# Altium project Shutdown_2019_v1.1.PrjPcb
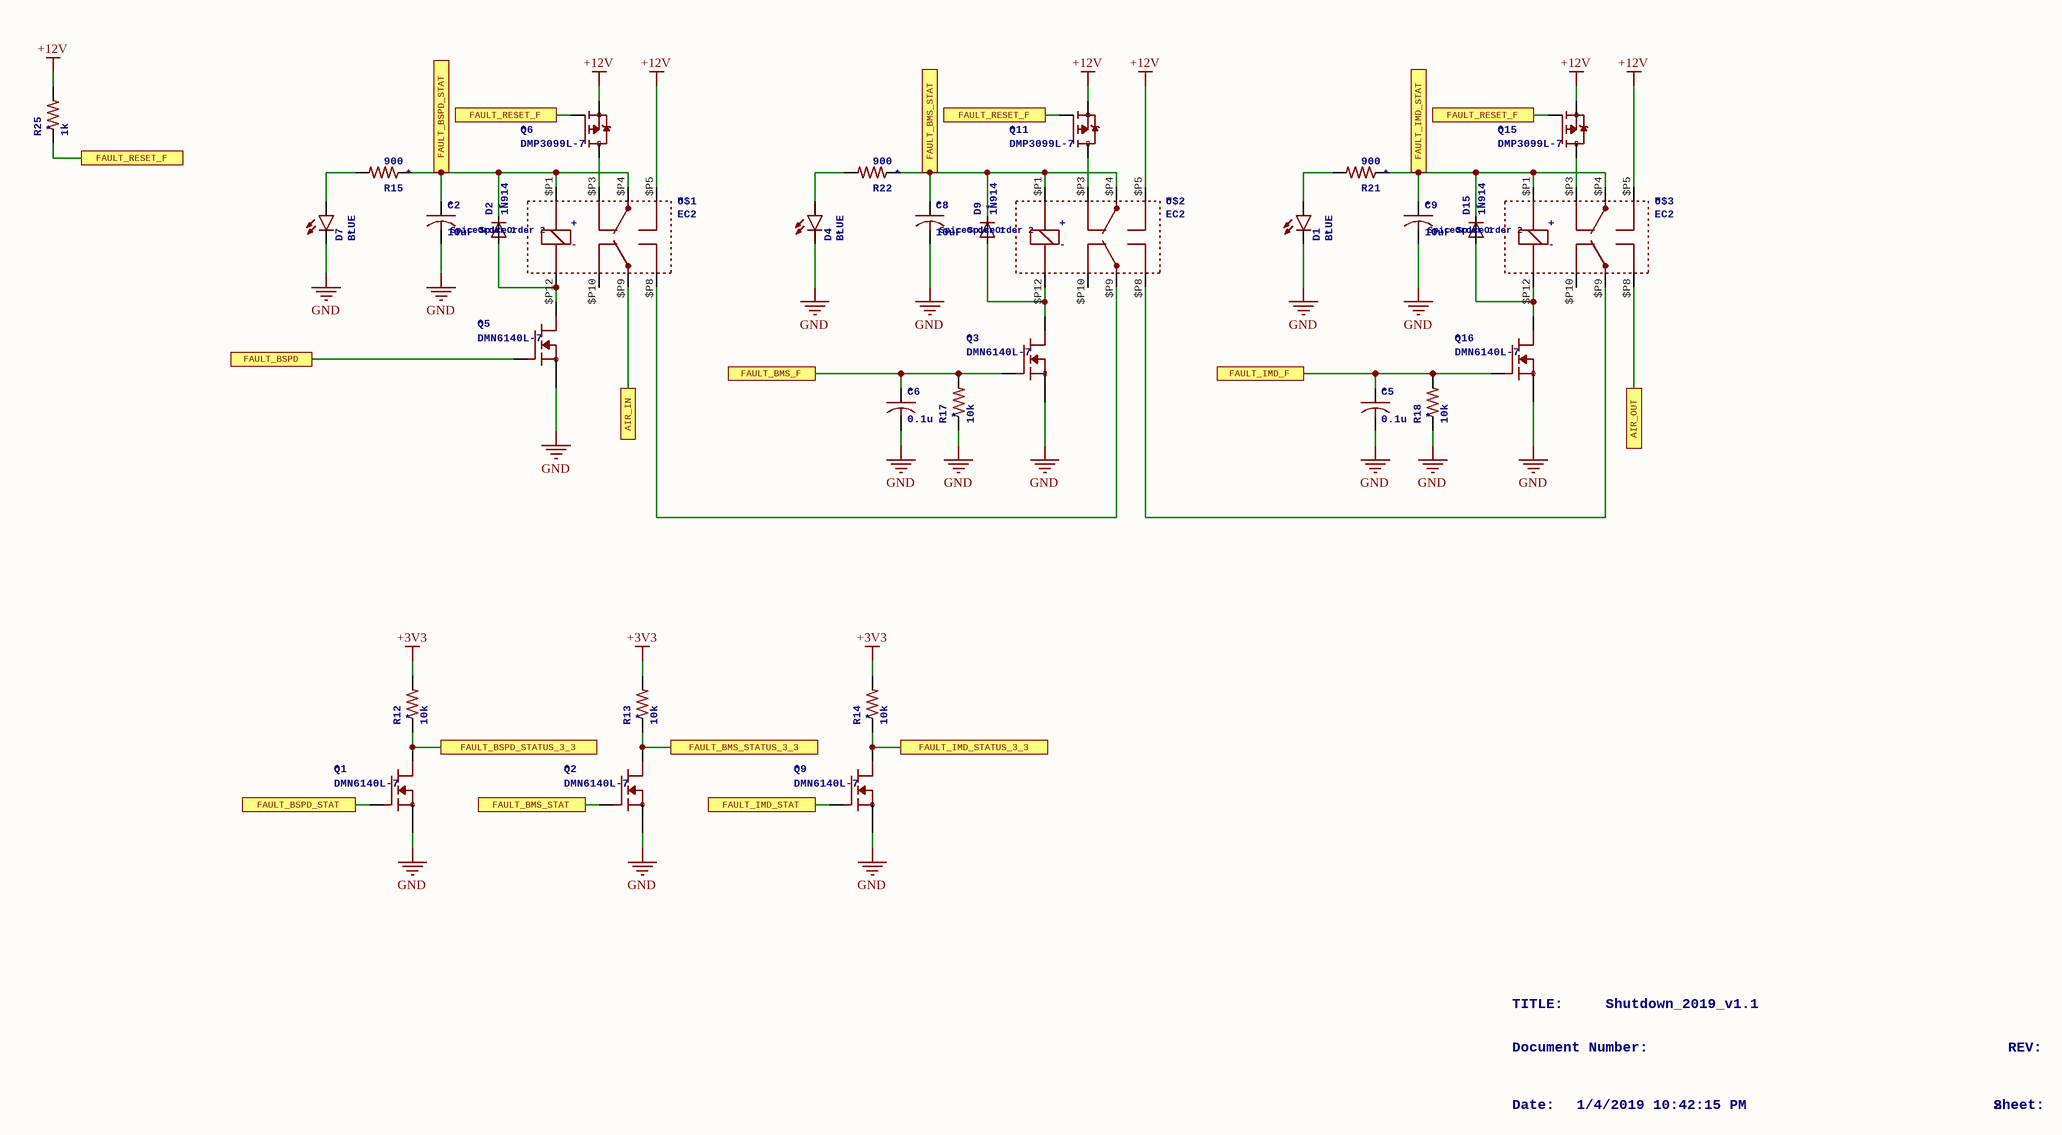
[diagram p0: Shutdown_2019_v1.1_Faults.SchDoc]
6 sheets, 116 parts. Net scope: flat (ports and power ports of the same name join across sheets).
Board file: Shutdown_2019_v1.1.PcbDoc
Sheets:
  Shutdown_2019_v1.1_Faults.SchDoc
  Shutdown_2019_v1.1_BSPD.SchDoc
  Shutdown_2019_v1.1_BrakeLight.SchDoc
  Shutdown_2019_v1.1_Power.SchDoc
  Shutdown_2019_v1.1_TractionCtl.SchDoc
  Shutdown_2019_v1.1_RTDS.SchDoc

## Sheet Shutdown_2019_v1.1_Faults.SchDoc: Shutdown_2019_v1.1
size 453 x 301 mm; Date: 1/4/2019 10:42:15 PM; SheetNumber: 2; GateName_1: G$1; SymbolName_1: FRAME_B_L; LibraryName: frames; DeviceSetName: FRAME_B_L; GateName_2: G$2; SymbolName_2: DOCFIELD

### Parts
C2  10uF  [C0805]
C5  0.1u  [C0603]
C6  0.1u  [C0603]
C8  10uF  [C0805]
C9  10uF  [C0805]
D1  BLUE  [LED-0603]
D2  1N914  SpiceOrder1: SpiceOrder 1  SpiceOrder2: SpiceOrder 2  [SOD323-F]
D4  BLUE  [LED-0603]
D7  BLUE  [LED-0603]
D9  1N914  SpiceOrder1: SpiceOrder 1  SpiceOrder2: SpiceOrder 2  [SOD323-F]
D15  1N914  SpiceOrder1: SpiceOrder 1  SpiceOrder2: SpiceOrder 2  [SOD323-F]
Q1  DMN6140L-7  [SOT23]
Q2  DMN6140L-7  [SOT23]
Q3  DMN6140L-7  [SOT23]
Q5  DMN6140L-7  [SOT23]
Q6  DMP3099L-7  [SOT23]
Q9  DMN6140L-7  [SOT23]
Q11  DMP3099L-7  [SOT23]
Q15  DMP3099L-7  [SOT23]
Q16  DMN6140L-7  [SOT23]
R12  10k  [R0603]
R13  10k  [R0603]
R14  10k  [R0603]
R15  900  [R0603]
R17  10k  [R0603]
R18  10k  [R0603]
R21  900  [R0603]
R22  900  [R0603]
R25  1k  [R0603]
U$1  EC2  [DPDT_2.54]
U$2  EC2  [DPDT_2.54]
U$3  EC2  [DPDT_2.54]

### Ports
AIR_IN, AIR_OUT, FAULT_BMS_F, FAULT_BMS_STAT, FAULT_BMS_STATUS_3_3, FAULT_BSPD, FAULT_BSPD_STAT, FAULT_BSPD_STATUS_3_3, FAULT_IMD_F, FAULT_IMD_STAT, FAULT_IMD_STATUS_3_3, FAULT_RESET_F

### Nets
+3V3: R12.2 R13.2 R14.2
+12V: Q6.2(S) Q11.2(S) Q15.2(S) R25.2 U$1.$P5 U$2.$P5 U$3.$P5
GND: C2.2 C5.2 C6.2 C8.2 C9.2 D1.C D4.C D7.C Q1.2(S) Q2.2(S) Q3.2(S) Q5.2(S) Q9.2(S) Q16.2(S) R17.1 R18.1
NetC2_1: C2.1 D2.C Q1.1(G) R15.1 U$1.$P1 U$1.$P4 ; port FAULT_BSPD_STAT
NetC5_1: C5.1 Q16.1(G) R18.2 ; port FAULT_IMD_F
NetC6_1: C6.1 Q3.1(G) R17.2 ; port FAULT_BMS_F
NetC8_1: C8.1 D9.C Q2.1(G) R22.1 U$2.$P1 U$2.$P4 ; port FAULT_BMS_STAT
NetC9_1: C9.1 D15.C Q9.1(G) R21.1 U$3.$P1 U$3.$P4 ; port FAULT_IMD_STAT
NetD1_A: D1.A R21.2
NetD2_A: D2.A Q5.3(D) U$1.$P12
NetD4_A: D4.A R22.2
NetD7_A: D7.A R15.2
NetD9_A: D9.A Q3.3(D) U$2.$P12
NetD15_A: D15.A Q16.3(D) U$3.$P12
NetQ1_3: Q1.3(D) R12.1 ; port FAULT_BSPD_STATUS_3_3
NetQ2_3: Q2.3(D) R13.1 ; port FAULT_BMS_STATUS_3_3
NetQ5_1: Q5.1(G) ; port FAULT_BSPD
NetQ6_1: Q6.1(G) Q11.1(G) Q15.1(G) R25.1 ; port FAULT_RESET_F
NetQ6_3: Q6.3(D) U$1.$P3
NetQ9_3: Q9.3(D) R14.1 ; port FAULT_IMD_STATUS_3_3
NetQ11_3: Q11.3(D) U$2.$P3
NetQ15_3: Q15.3(D) U$3.$P3
NetU$1_$P8: U$1.$P8 U$2.$P9
NetU$1_$P9: U$1.$P9 ; port AIR_IN
NetU$2_$P8: U$2.$P8 U$3.$P9
NetU$3_$P8: U$3.$P8 ; port AIR_OUT

Not connected (* = marked no-connect by the designer): U$1 $P10; U$2 $P10; U$3 $P10

### Notes on the sheet
- TITLE:
- Document Number:
- Shutdown_2019_v1.1
- REV:
- Date:
- 1/4/2019 10:42:15 PM
- Sheet:
- 2
- 1
- 3
- 4
- 5
- 6
- 7
- 8
- 9
- A
- B
- C
- D
- E
- F

### Library data of the parts
C2 C8 C9 = C-USC0805: CAPACITOR, American symbol; GateName_1: G$1; SymbolName_1: C-US; DeviceName: C0805; LibraryName: rcl; DeviceSetName: C-US; NAME: *; SPICEPREFIX: C
C5 C6 = C-USC0603: CAPACITOR, American symbol; GateName_1: G$1; SymbolName_1: C-US-1; DeviceSetName: C-US; DeviceName: C0603; LibraryName: resistor; NAME: *
D1 D4 D7 = LED-BLUE0603: Blue LEDs for production useVarious blue LEDs stocked by SparkFun production0603 - DIO-08575Rebel - DIO-095531206 - DIO-09911; GateName_1: G$1; SymbolName_1: LED; DeviceName: 0603; LibraryName: SparkFun-LED; DeviceSetName: LED-BLUE; NAME: *; PROD_ID: DIO-08575
D2 D9 D15 = 1N914: GateName_1: G$1; SymbolName_1: D; LibraryName: Diodes; DeviceSetName: 1N914; NAME: *
Q1-Q3 Q5 Q9 Q16 = DMN6140L-7: DMN6140L-7 Vgs(th) = 3V, Rds(on) = 140mOhm, Vds(max) = 60V; GateName_1: G$1; SymbolName_1: N-MOSFET-GDS; LibraryName: TRANS; DeviceSetName: DMN6140L-7; NAME: *
Q6 Q11 Q15 = DMP3099L-7: DMP3099L-7  P-Channel Vgs(th) = 2.1V, Rds(on) = 64 mohm, Vds(max) = 30V; GateName_1: G$1; SymbolName_1: P-MOSFET; LibraryName: TRANS; DeviceSetName: DMP3099L-7; NAME: *
R12-R15 R17 R18 R21 R22 R25 = R-US_R0603: RESISTOR, American symbol; GateName_1: G$1; SymbolName_1: R-US; DeviceSetName: R-US_; DeviceName: R0603; LibraryName: resistor; NAME: *
U$1-U$3 = EC2: KEMET EC2 DPDT General Purpose 2A Relay. 12V coil voltage.Datasheet Digikey; GateName_1: G$1; SymbolName_1: MONOSTABLERELAY; LibraryName: KEMET; DeviceSetName: EC2; NAME: *; +: +; -: -

## Sheet Shutdown_2019_v1.1_BSPD.SchDoc: Shutdown_2019_v1.1
size 453 x 301 mm; Date: 1/4/2019 10:42:16 PM; SheetNumber: 3; GateName_1: G$1; SymbolName_1: FRAME_B_L; LibraryName: frames; DeviceSetName: FRAME_B_L; GateName_2: G$2; SymbolName_2: DOCFIELD
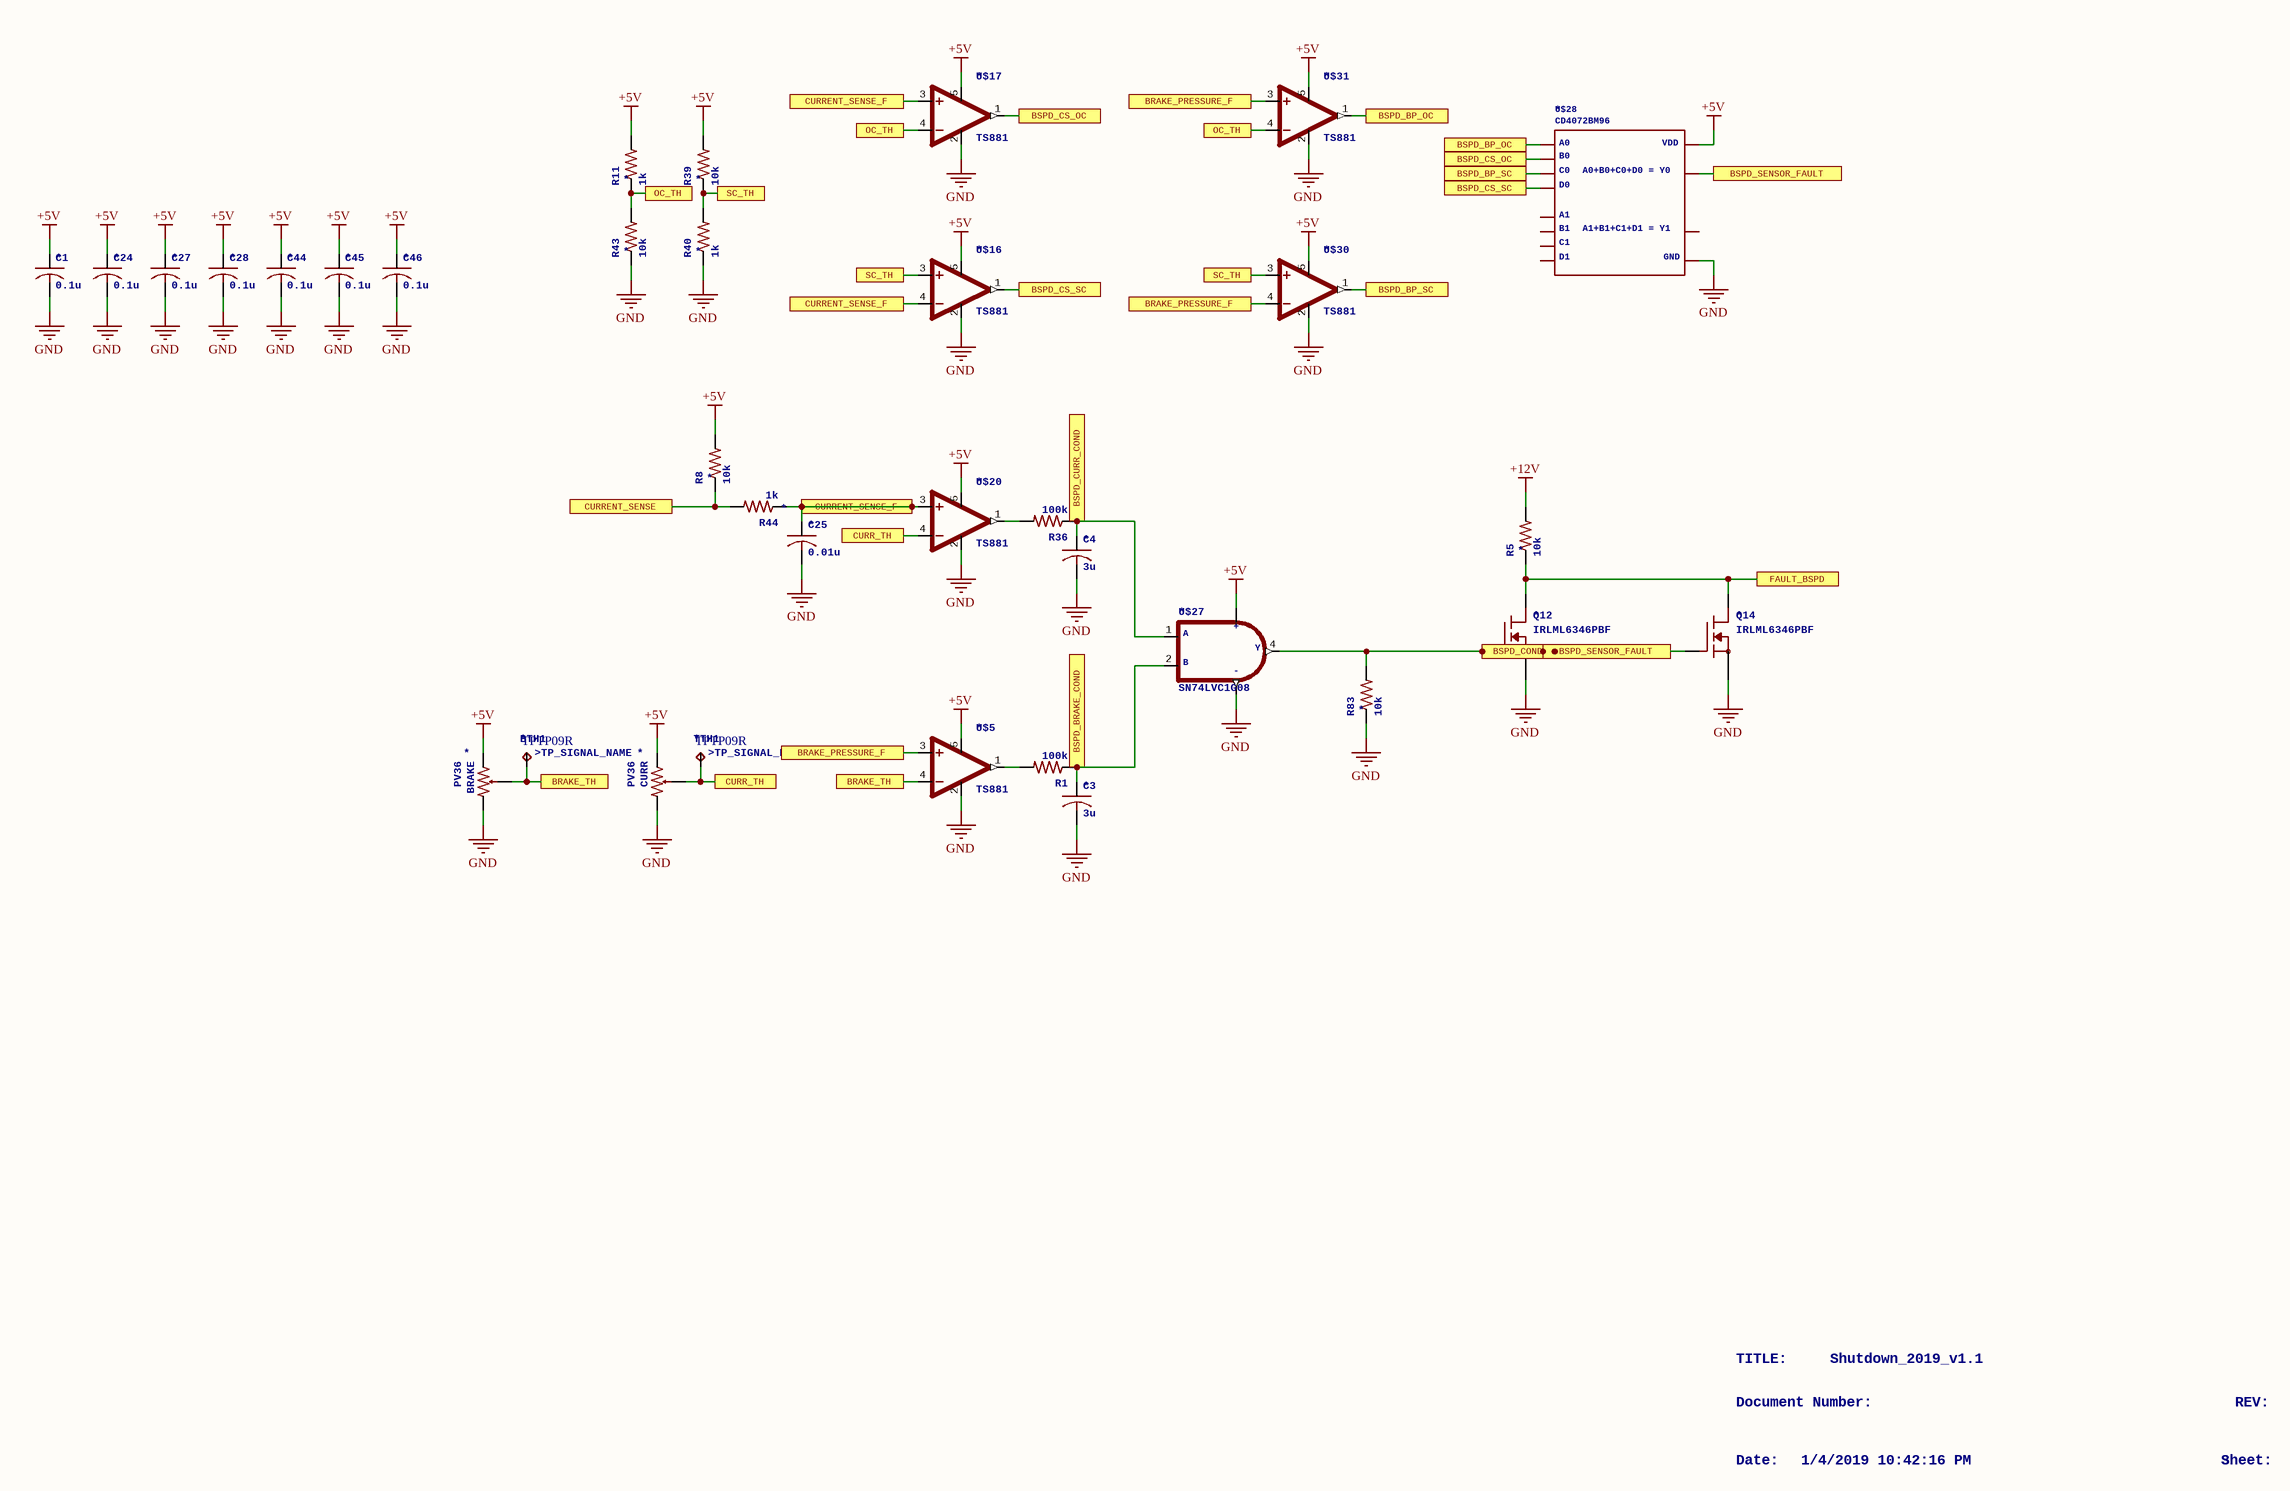
[diagram p1: Shutdown_2019_v1.1_BSPD.SchDoc]

### Parts
BRAKE  PV36  [PV36]
BTH1  TPTP09R  TP_SIGNAL_NAME: >TP_SIGNAL_NAME  [TP09R]
C1  0.1u  [C0603]
C3  3u  [C0603]
C4  3u  [C0603]
C24  0.1u  [C0603]
C25  0.01u  [C0603]
C27  0.1u  [C0603]
C28  0.1u  [C0603]
C44  0.1u  [C0603]
C45  0.1u  [C0603]
C46  0.1u  [C0603]
CURR  PV36  [PV36]
Q12  IRLML6346PBF  [SOT23]
Q14  IRLML6346PBF  [SOT23]
R1  100k  [R0603]
R5  10k  [R0603]
R8  10k  [R0603]
R11  1k  [R0603]
R36  100k  [R0603]
R39  10k  [R0603]
R40  1k  [R0603]
R43  10k  [R0603]
R44  1k  [R0603]
R83  10k  [R0603]
TTH1  TPTP09R  TP_SIGNAL_NAME: >TP_SIGNAL_NAME  [TP09R]
U$5  TS881  [SOT23-5]
U$16  TS881  [SOT23-5]
U$17  TS881  [SOT23-5]
U$20  TS881  [SOT23-5]
U$27  SN74LVC1G08  [SOT23-5]
U$28  CD4072BM96  A0+B0+C0+D0=Y0: A0+B0+C0+D0 = Y0  A1+B1+C1+D1=Y1: A1+B1+C1+D1 = Y1  [SOIC8]
U$30  TS881  [SOT23-5]
U$31  TS881  [SOT23-5]

### Ports
BRAKE_PRESSURE_F, BRAKE_TH, BSPD_BP_OC, BSPD_BP_SC, BSPD_BRAKE_COND, BSPD_COND, BSPD_CS_OC, BSPD_CS_SC, BSPD_CURR_COND, BSPD_SENSOR_FAULT, CURR_TH, CURRENT_SENSE, CURRENT_SENSE_F, FAULT_BSPD, OC_TH, SC_TH

### Nets
+5V: BRAKE.A C1.1 C24.1 C27.1 C28.1 C44.1 C45.1 C46.1 CURR.A R8.2 R11.2 R39.2 U$5.5(VDD) U$16.5(VDD) U$17.5(VDD) U$20.5(VDD) U$27.5(VDD) U$28.P14(VDD) U$30.5(VDD) U$31.5(VDD)
+12V: R5.2
GND: BRAKE.B C1.2 C3.2 C4.2 C24.2 C25.2 C27.2 C28.2 C44.2 C45.2 C46.2 CURR.B Q12.2(S) Q14.2(S) R40.1 R43.1 R83.1 U$5.2(GND) U$16.2(GND) U$17.2(GND) U$20.2(GND) U$27.3(GND) U$28.P7(GND) U$30.2(GND) U$31.2(GND)
NetBRAKE_W: BRAKE.W BTH1.TP U$5.4(-IN) ; port BRAKE_TH
NetC3_1: C3.1 R1.1 U$27.2(B) ; port BSPD_BRAKE_COND
NetC4_1: C4.1 R36.1 U$27.1(A) ; port BSPD_CURR_COND
NetC25_1: C25.1 R44.1 U$16.4(-IN) U$17.3(+IN) U$20.3(+IN) ; port CURRENT_SENSE_F
NetCURR_W: CURR.W TTH1.TP U$20.4(-IN) ; port CURR_TH
NetQ5_1: Q12.3(D) Q14.3(D) R5.1 ; port FAULT_BSPD
NetQ12_1: Q12.1(G) R83.2 U$27.4(Y) ; port BSPD_COND
NetQ14_1: Q14.1(G) U$28.P1(Y0) ; port BSPD_SENSOR_FAULT
NetR1_2: R1.2 U$5.1(OUT)
NetR8_1: R8.1 R44.2 ; port CURRENT_SENSE
NetR11_1: R11.1 R43.2 U$17.4(-IN) U$31.4(-IN) ; port OC_TH
NetR36_2: R36.2 U$20.1(OUT)
NetR39_1: R39.1 R40.2 U$16.3(+IN) U$30.3(+IN) ; port SC_TH
NetU$5_3: U$5.3(+IN) U$30.4(-IN) U$31.3(+IN) ; port BRAKE_PRESSURE_F
NetU$16_1: U$16.1(OUT) U$28.P5(D0) ; port BSPD_CS_SC
NetU$17_1: U$17.1(OUT) U$28.P3(B0) ; port BSPD_CS_OC
NetU$28_P2: U$28.P2(A0) U$31.1(OUT) ; port BSPD_BP_OC
NetU$28_P4: U$28.P4(C0) U$30.1(OUT) ; port BSPD_BP_SC

Not connected (* = marked no-connect by the designer): U$28 P9(A1) P10(B1) P11(C1) P12(D1) P13(Y1)

### Notes on the sheet
- TITLE:
- Document Number:
- Shutdown_2019_v1.1
- REV:
- Date:
- 1/4/2019 10:42:16 PM
- Sheet:
- 3
- 1
- 2
- 4
- 5
- 6
- 7
- 8
- 9
- A
- B
- C
- D
- E
- F

### Library data of the parts
BRAKE CURR = PV36: BOURNS PV36  Bourns PV36 Potentiometer Datasheet; GateName_1: G$1; SymbolName_1: POTENTIOMETER; LibraryName: BOURNS; DeviceSetName: PV36; NAME: *
BTH1 TTH1 = TPTP09R: Test pad; GateName_1: G$1; SymbolName_1: TP; DeviceName: TP09R; LibraryName: testpad; DeviceSetName: TP; NAME: *
C1 C3 C4 C24 C25 C27 C28 C44-C46 = C-USC0603: as C5 on sheet Shutdown_2019_v1.1_Faults; DeviceName: C0603; LibraryName: resistor; NAME: *
Q12 Q14 = IRLML6346PBF: IRLML6346TRPBF Vgs(th) = 1.1V, Rds(on) = 63 mOhm, Vds(max) = 30V; GateName_1: G$1; SymbolName_1: N-MOSFET-GDS; LibraryName: TRANS; DeviceSetName: IRLML6346PBF; NAME: *
R1 R5 R8 R11 R36 R39 R40 R43 R44 R83 = R-US_R0603: as R12 on sheet Shutdown_2019_v1.1_Faults; DeviceName: R0603; LibraryName: resistor; NAME: *
U$5 U$16 U$17 U$20 U$30 U$31 = TS881: STM TS881Single rail to rail comparator with push pull output.Datasheet; GateName_1: G$1; SymbolName_1: OP-AMP; LibraryName: STM; DeviceSetName: TS881; NAME: *
U$27 = SN74LVC1G08: Texas Insturments SN74LVC1G08   Single 2-Input Positive-AND Gate  Datasheet; GateName_1: G$1; SymbolName_1: AND; LibraryName: TEXAS_INSTRUMENTS; DeviceSetName: SN74LVC1G08; NAME: *; A: A; B: B; Y: Y; +: +; -: -
U$28 = CD4072B: TI CD4072BM96 Quad Input 2 Channel OR Gate SOIC-14 Datasheet; GateName_1: G$1; SymbolName_1: QUAD_INPUT_OR; LibraryName: TEXAS_INSTRUMENTS; DeviceSetName: CD4072B; NAME: *; A0: A0; B0: B0; C0: C0; D0: D0; A1: A1; B1: B1; C1: C1; D1: D1; VDD: VDD; GND: GND

## Sheet Shutdown_2019_v1.1_BrakeLight.SchDoc: Shutdown_2019_v1.1
size 453 x 301 mm; Date: 1/4/2019 10:42:18 PM; SheetNumber: 4; GateName_1: G$1; SymbolName_1: FRAME_B_L; LibraryName: frames; DeviceSetName: FRAME_B_L; GateName_2: G$2; SymbolName_2: DOCFIELD
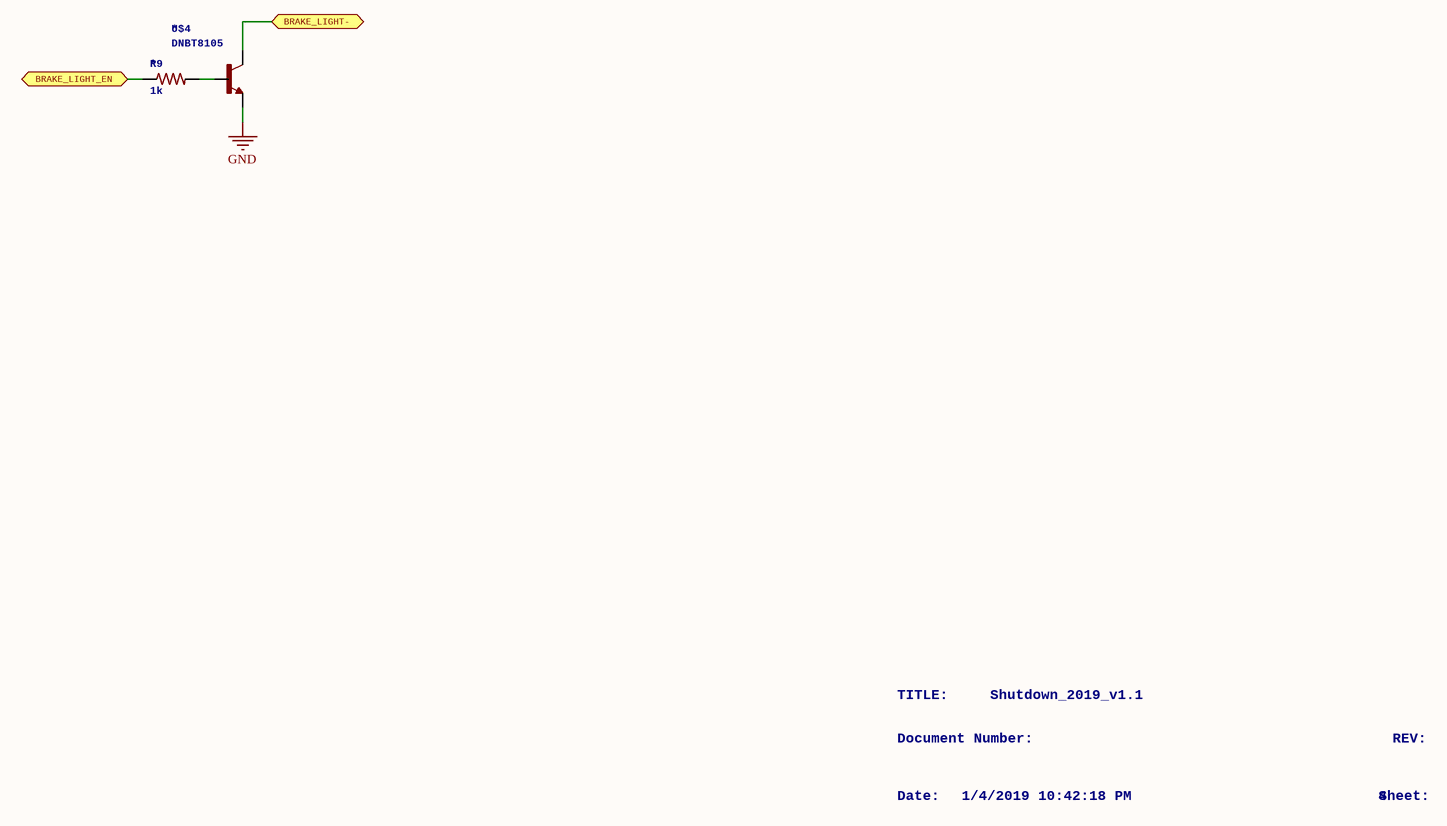
[diagram p2: Shutdown_2019_v1.1_BrakeLight.SchDoc]

### Parts
R9  1k  [R0603]
U$4  DNBT8105  [SOT23-3]

### Ports
BRAKE_LIGHT-, BRAKE_LIGHT_EN

### Nets
GND: U$4.2(E)
NetR9_1: R9.1 ; port BRAKE_LIGHT_EN
NetR9_2: R9.2 U$4.1(B)
NetU$4_3: U$4.3(C) ; port BRAKE_LIGHT-

### Notes on the sheet
- TITLE:
- Document Number:
- Shutdown_2019_v1.1
- REV:
- Date:
- 1/4/2019 10:42:18 PM
- Sheet:
- 4
- 1
- 2
- 3
- 5
- 6
- 7
- 8
- 9
- A
- B
- C
- D
- E
- F

### Library data of the parts
R9 = R-US_R0603: as R12 on sheet Shutdown_2019_v1.1_Faults; DeviceName: R0603; LibraryName: rcl; NAME: *; SPICEPREFIX: R
U$4 = DNBT8105: DNBT8105 Diodes Inc 1A NPN SURFACE MOUNT TRANSISTOR  Vce = 60V, Ice = 1A, h=100, Vbe = 1.1V https://www.diodes.com/assets/Datasheets/ds30513.pdf; GateName_1: G$1; SymbolName_1: NPN; LibraryName: DIODES_INC; DeviceSetName: DNBT8105; NAME: *

## Sheet Shutdown_2019_v1.1_Power.SchDoc: Shutdown_2019_v1.1
size 453 x 301 mm; Date: 1/4/2019 10:42:21 PM; SheetNumber: 6; GateName_1: G$1; SymbolName_1: FRAME_B_L; LibraryName: frames; DeviceSetName: FRAME_B_L; GateName_2: G$2; SymbolName_2: DOCFIELD
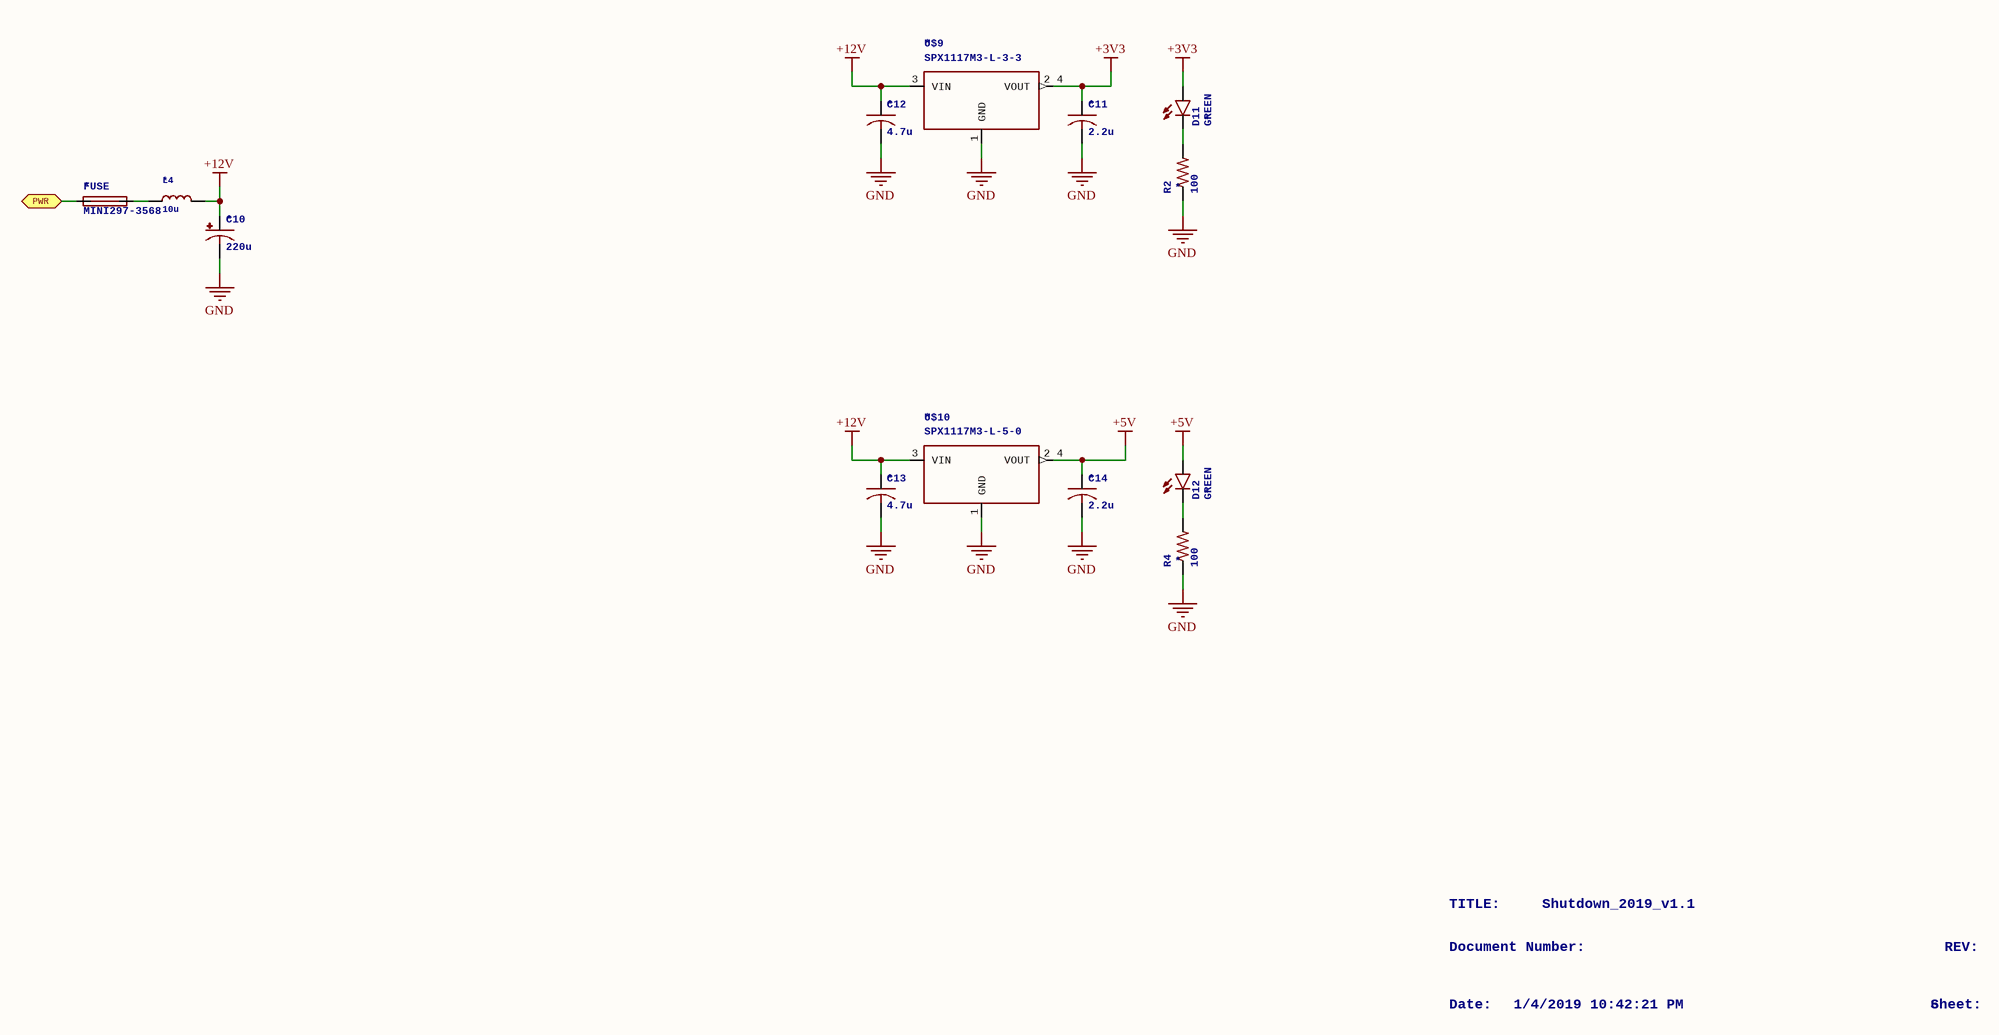
[diagram p3: Shutdown_2019_v1.1_Power.SchDoc]

### Parts
C10  220u  [E2,5-7]
C11  2.2u  [C0805]
C12  4.7u  [C0805]
C13  4.7u  [C0805]
C14  2.2u  [C0805]
D11  GREEN  [LED-0603]
D12  GREEN  [LED-0603]
FUSE  MINI297-3568  [3568]
L4  10u  [INDUCTOR_5X5MM_NR5040_NOTHERMALS]
R2  100  [R0603]
R4  100  [R0603]
U$9  SPX1117M3-L-3-3  [SOT223]
U$10  SPX1117M3-L-5-0  [SOT223]

### Ports
PWR

### Nets
+3V3: C11.1 D11.A U$9.2_4(VOUT)
+5V: C14.1 D12.A U$10.2_4(VOUT)
+12V: C10.+ C12.1 C13.1 L4.P$2 U$9.3(VIN) U$10.3(VIN)
GND: C10.- C11.2 C12.2 C13.2 C14.2 R2.1 R4.1 U$9.1(GND) U$10.1(GND)
NetD11_C: D11.C R2.2
NetD12_C: D12.C R4.2
NetFUSE_P$1 P$4: FUSE.P$1_P$4 ; port PWR
NetFUSE_P$2 P$3: FUSE.P$2_P$3 L4.P$1

### Notes on the sheet
- TITLE:
- Document Number:
- Shutdown_2019_v1.1
- REV:
- Date:
- 1/4/2019 10:42:21 PM
- Sheet:
- 6
- 1
- 2
- 3
- 4
- 5
- 7
- 8
- 9
- A
- B
- C
- D
- E
- F

### Library data of the parts
C10 = CPOL-USE2.5-7: POLARIZED CAPACITOR, American symbol; GateName_1: G$1; DeviceName: E2.5-7; SymbolName_1: CPOL-US; LibraryName: rcl; DeviceSetName: CPOL-US; NAME: *; SPICEPREFIX: C
C11-C14 = C-USC0805: as C2 on sheet Shutdown_2019_v1.1_Faults; DeviceName: C0805; LibraryName: rcl; DeviceSetName: C-US; NAME: *; SPICEPREFIX: C
D11 D12 = LED-GREEN0603: Various green LEDsGreen LEDs used in SFE Production0603- DIO-00821LARGE- DIO-00862LILYPAD- DIO-09910; GateName_1: G$1; SymbolName_1: LED; DeviceName: 0603; LibraryName: SparkFun-LED; DeviceSetName: LED-GREEN; NAME: *; PROD_ID: DIO-00821
FUSE = MINI297-3568: GateName_1: G$1; SymbolName_1: FUSE; LibraryName: Fuse; DeviceSetName: MINI297-3568; NAME: *
L4 = INDUCTORNR5040: Inductors0603:0805:1007 (2518 Metric) SMT:5.0x5.0mm (Taiyo Yuden NR5040 Series)5.0x5.0mm (TDK VLC5045 Series)6.0x6.0mm (TDK VLC6045 Series)6.0x6.0mm (TDK SLF6045 Series)6.0x6.0mm (Sumida CDRH5D28 Series)Taiyo Yuden NR3015T2R2M - 2.2uH 20% 1.5A (Digikey: 587-1648-2-ND, Mouser: 963-NR3015T2R2M) - Used with TI TPS62172CoilCraft RFID Transponder Coil - MA5532-AE (For use with AS3935 Lightning Sensor); GateName_1: G$1; SymbolName_1: INDUCTOR; DeviceName: NR5040; LibraryName: microbuilder; DeviceSetName: INDUCTOR; NAME: *
R2 R4 = R-US_R0603: as R12 on sheet Shutdown_2019_v1.1_Faults; DeviceName: R0603; LibraryName: rcl; NAME: *; SPICEPREFIX: R
U$9 = SPX1117M3-L-3-3: SPX1117M3-L-3-3 3.3V 800mA LDOMaxLinear IncDatasheetDigikey; GateName_1: G$1; SymbolName_1: 3_TERMINAL_FIXED_LDO; LibraryName: MAXLINEAR; DeviceSetName: SPX1117M3-L-3-3; NAME: *
U$10 = SPX1117M3-L-5-0: SPX1117M3-L-5-0 5.0V 800mA LDOMaxLinear IncDatasheetDigikey; GateName_1: G$1; SymbolName_1: 3_TERMINAL_FIXED_LDO; LibraryName: MAXLINEAR; DeviceSetName: SPX1117M3-L-5-0; NAME: *

## Sheet Shutdown_2019_v1.1_TractionCtl.SchDoc: Shutdown_2019_v1.1
size 453 x 301 mm; Date: 1/4/2019 10:42:25 PM; SheetNumber: 9; GateName_1: G$1; SymbolName_1: FRAME_B_L; LibraryName: frames; DeviceSetName: FRAME_B_L; GateName_2: G$2; SymbolName_2: DOCFIELD
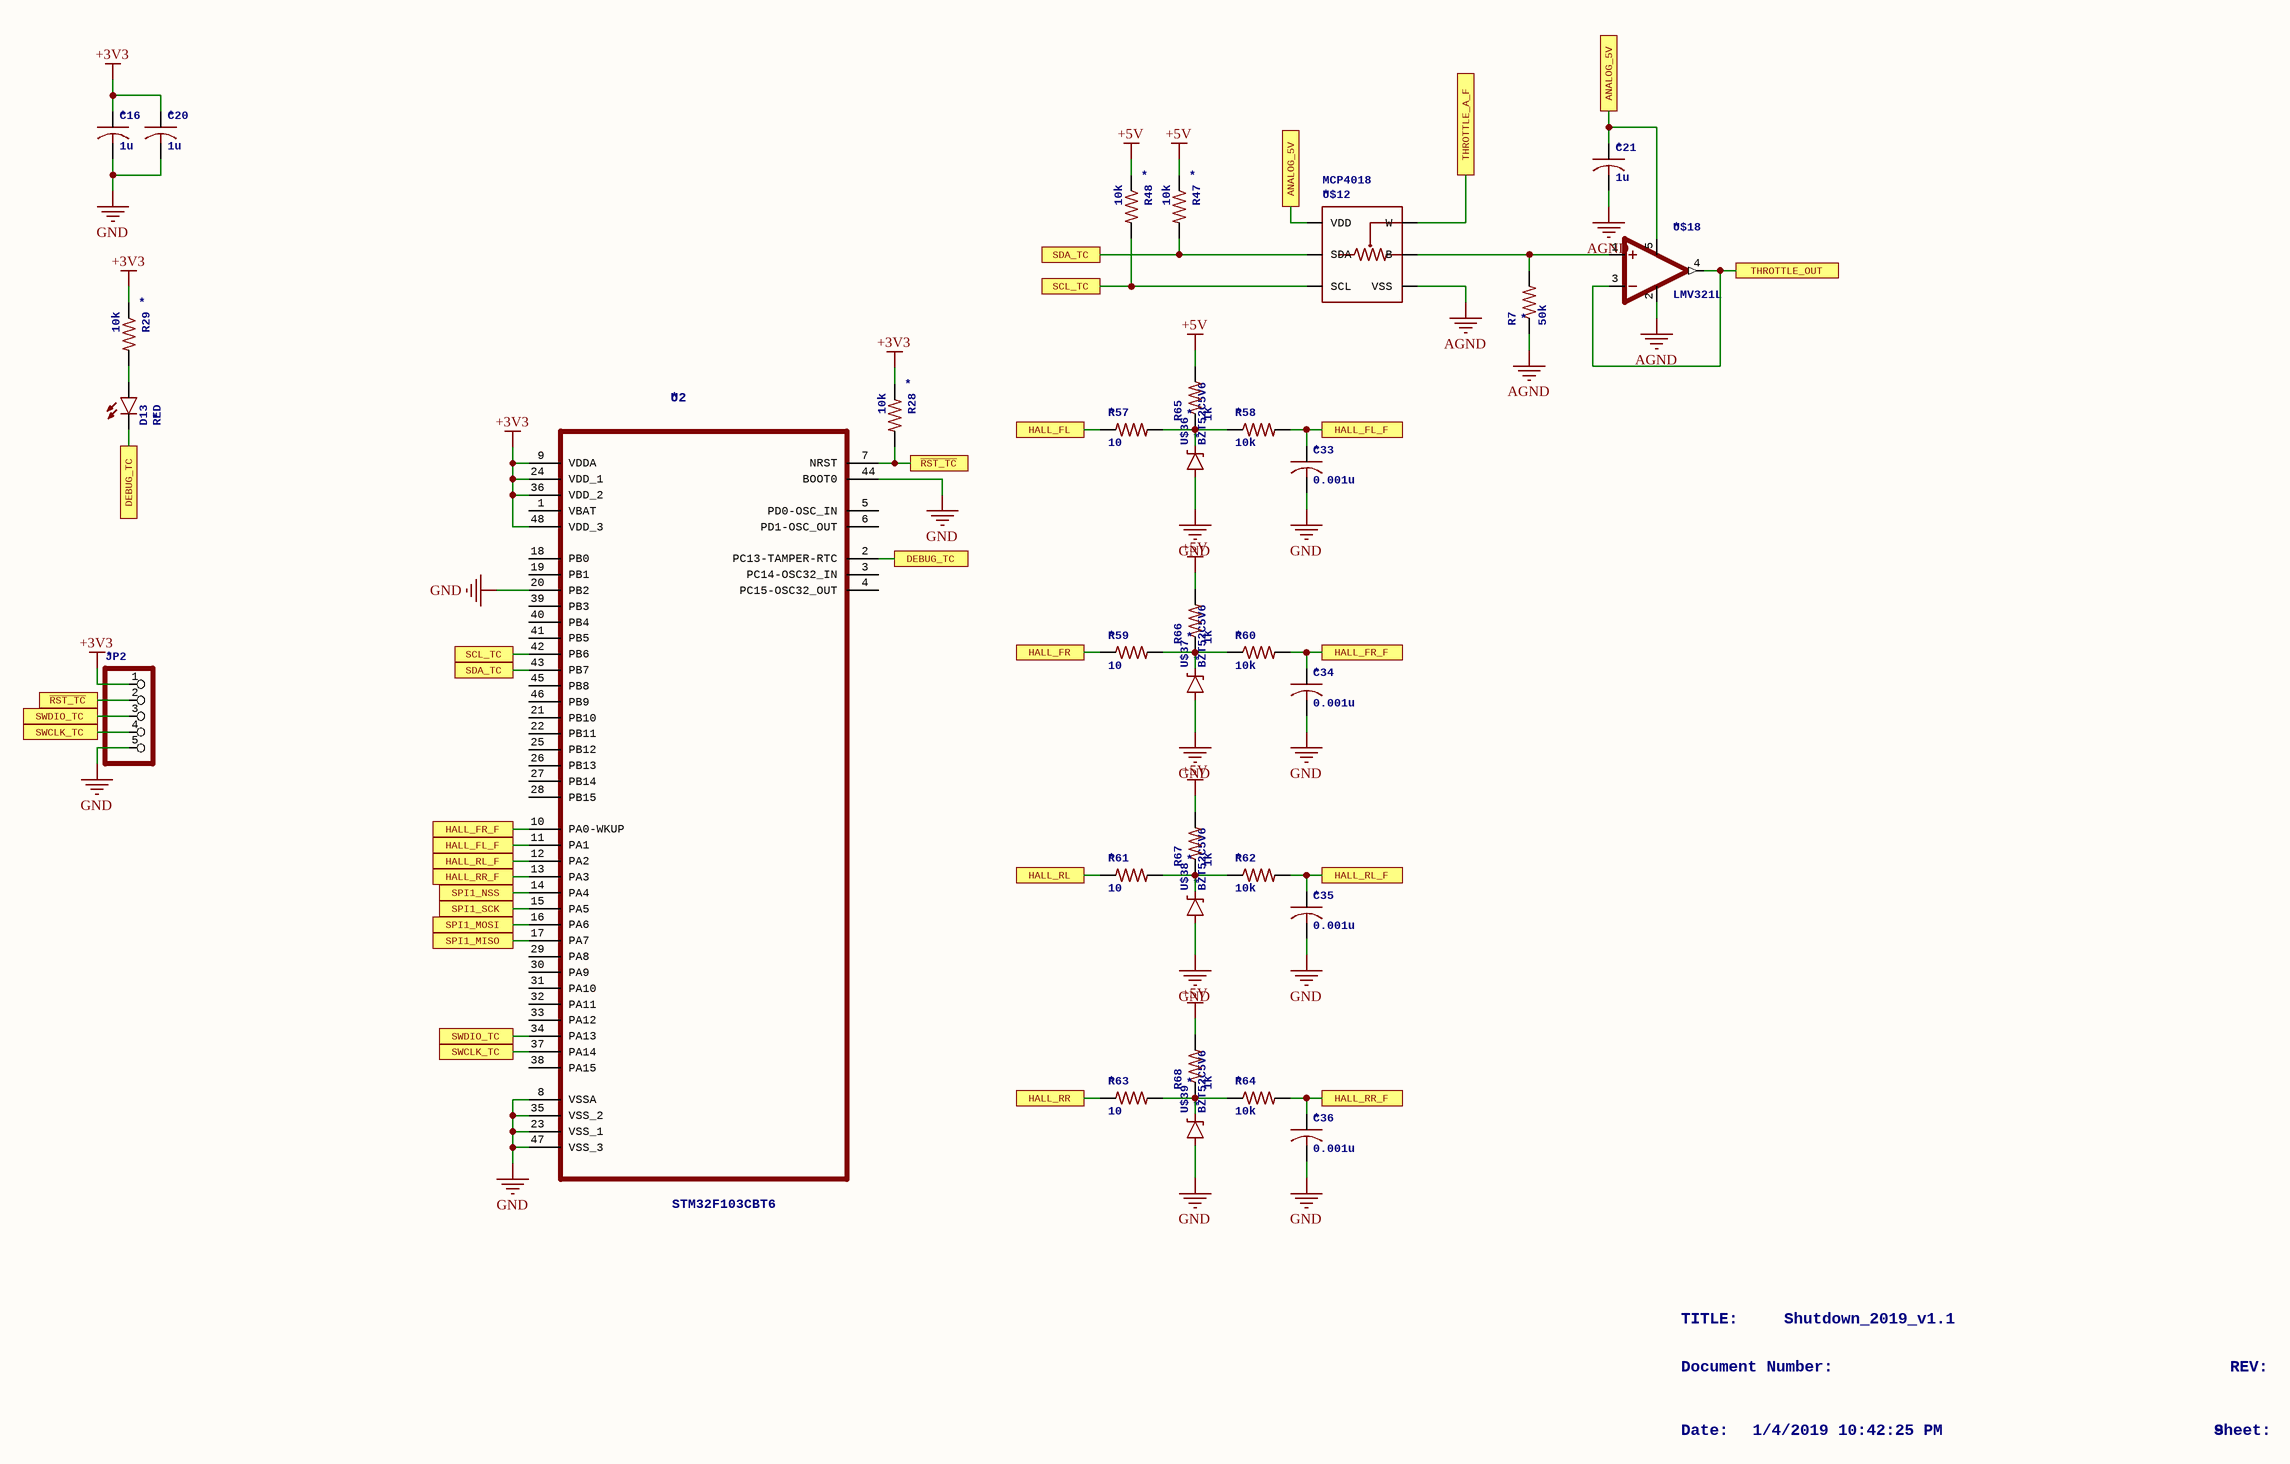
[diagram p4: Shutdown_2019_v1.1_TractionCtl.SchDoc]

### Parts
C16  1u  [C0805]
C20  1u  [C0805]
C21  1u  [C0603]
C33  0.001u  [C0805]
C34  0.001u  [C0805]
C35  0.001u  [C0805]
C36  0.001u  [C0805]
D13  RED  [LED-0603]
JP2  PINHD-1X5  [1X05]  (value not drawn)
R7  50k  [R0603]
R28  10k  [R0603]
R29  10k  [R0603]
R47  10k  [R0603]
R48  10k  [R0603]
R57  10  [R0603]
R58  10k  [R0603]
R59  10  [R0603]
R60  10k  [R0603]
R61  10  [R0603]
R62  10k  [R0603]
R63  10  [R0603]
R64  10k  [R0603]
R65  1k  [R0603]
R66  1k  [R0603]
R67  1k  [R0603]
R68  1k  [R0603]
U2  STM32F103CBT6  [QFP50P900X900X160-48N]
U$12  MCP4018  [SOT23-6]
U$18  LMV321L  [SOT23-5]
U$36  BZT52C5V6  [SOD-123]
U$37  BZT52C5V6  [SOD-123]
U$38  BZT52C5V6  [SOD-123]
U$39  BZT52C5V6  [SOD-123]

### Ports
ANALOG_5V, DEBUG_TC, HALL_FL, HALL_FL_F, HALL_FR, HALL_FR_F, HALL_RL, HALL_RL_F, HALL_RR, HALL_RR_F, SCL_TC, SDA_TC, SPI1_MISO, SPI1_MOSI, SPI1_NSS, SPI1_SCK, SWCLK_TC, SWDIO_TC, THROTTLE_A_F, THROTTLE_OUT, ~{RST_TC}

### Nets
+3V3: C16.1 C20.1 JP2.1 R28.1 R29.1 U2.9(VDDA) U2.24(VDD_1) U2.36(VDD_2) U2.48(VDD_3)
+5V: R47.1 R48.1 R65.2 R66.2 R67.2 R68.2
AGND: C21.2 R7.1 U$12.2(VSS) U$18.2(GND)
GND: C16.2 C20.2 C33.2 C34.2 C35.2 C36.2 JP2.5 U2.8(VSSA) U2.20(PB2) U2.23(VSS_1) U2.35(VSS_2) U2.44(BOOT0) U2.47(VSS_3) U$36.A U$37.A U$38.A U$39.A
NetC21_1: C21.1 U$12.1(VDD) U$18.5(VDD) ; port ANALOG_5V
NetC33_1: C33.1 R58.2 U2.11(PA1) ; port HALL_FL_F
NetC34_1: C34.1 R60.2 U2.10(PA0-WKUP) ; port HALL_FR_F
NetC35_1: C35.1 R62.2 U2.12(PA2) ; port HALL_RL_F
NetC36_1: C36.1 R64.2 U2.13(PA3) ; port HALL_RR_F
NetD13_A: D13.A R29.2
NetD13_C: D13.C U2.2(PC13-TAMPER-RTC) ; port DEBUG_TC
NetJP2_2: JP2.2 R28.2 U2.7(NRST) ; port ~{RST_TC}
NetJP2_3: JP2.3 U2.34(PA13) ; port SWDIO_TC
NetJP2_4: JP2.4 U2.37(PA14) ; port SWCLK_TC
NetR7_2: R7.2 U$12.5(B) U$18.1(+IN)
NetR47_2: R47.2 U2.43(PB7) U$12.4(SDA) ; port SDA_TC
NetR48_2: R48.2 U2.42(PB6) U$12.3(SCL) ; port SCL_TC
NetR57_1: R57.1 ; port HALL_FL
NetR57_2: R57.2 R58.1 R65.1 U$36.C
NetR59_1: R59.1 ; port HALL_FR
NetR59_2: R59.2 R60.1 R66.1 U$37.C
NetR61_1: R61.1 ; port HALL_RL
NetR61_2: R61.2 R62.1 R67.1 U$38.C
NetR63_1: R63.1 ; port HALL_RR
NetR63_2: R63.2 R64.1 R68.1 U$39.C
NetU2_14: U2.14(PA4) ; port SPI1_NSS
NetU2_15: U2.15(PA5) ; port SPI1_SCK
NetU2_16: U2.16(PA6) ; port SPI1_MOSI
NetU2_17: U2.17(PA7) ; port SPI1_MISO
NetU$12_6: U$12.6(W) ; port THROTTLE_A_F
NetU$18_3: U$18.3(-IN) U$18.4(OUT) ; port THROTTLE_OUT

Not connected (* = marked no-connect by the designer): U2 1(VBAT) 3(PC14-OSC32_IN) 4(PC15-OSC32_OUT) 5(PD0-OSC_IN) 6(PD1-OSC_OUT) 18(PB0) 19(PB1) 21(PB10) 22(PB11) 25(PB12) 26(PB13) 27(PB14) 28(PB15) 29(PA8) 30(PA9) 31(PA10) 32(PA11) 33(PA12) 38(PA15) 39(PB3) 40(PB4) 41(PB5) 45(PB8) 46(PB9)

### Notes on the sheet
- TITLE:
- Document Number:
- Shutdown_2019_v1.1
- REV:
- Date:
- 1/4/2019 10:42:25 PM
- Sheet:
- 9
- 1
- 2
- 3
- 4
- 5
- 6
- 7
- 8
- A
- B
- C
- D
- E
- F

### Library data of the parts
C16 C20 C33-C36 = C-USC0805: as C2 on sheet Shutdown_2019_v1.1_Faults; DeviceName: C0805; LibraryName: rcl; DeviceSetName: C-US; NAME: *; SPICEPREFIX: C
C21 = C-USC0603: CAPACITOR, American symbol; GateName_1: G$1; SymbolName_1: C-US; DeviceName: C0603; LibraryName: rcl; DeviceSetName: C-US; NAME: *; SPICEPREFIX: C
D13 = LED-RED0603: Assorted Red LEDsLilyPad 1206- DIO-099121206- DIO-008090603- DIO-00819"SMART" means more efficient and expensive; GateName_1: G$1; SymbolName_1: LED; DeviceName: 0603; LibraryName: SparkFun-LED; DeviceSetName: LED-RED; NAME: *; PROD_ID: DIO-00819
JP2 = PINHD-1X5: PIN HEADER; GateName_1: A; SymbolName_1: PINHD5; LibraryName: Headers_IFE; DeviceSetName: PINHD-1X5; NAME: *
R7 R28 R29 R47 R48 R57-R68 = R-US_R0603: as R12 on sheet Shutdown_2019_v1.1_Faults; DeviceName: R0603; LibraryName: rcl; NAME: *; SPICEPREFIX: R
U2 = STM32F103CBT6: Medium-density performance line ARM-based 32-bit MCU; GateName_1: A; SymbolName_1: STM32F103CBT6; LibraryName: ST Microelctronics_By_element14_Batch_1; DeviceSetName: STM32F103CBT6; MPN: STM32F103CBT6; NAME: *; OC_FARNELL: 1606327; OC_NEWARK: 11N8296; PACKAGE: QFP-48; SUPPLIER: STMICROELECTRONICS
U$12 = MCP4018: MICROCHIP MCP40187-Bit Single I2Câ„¢ Digital POT with Volatile Memory in SC70Datasheet; GateName_1: G$1; SymbolName_1: MCP4018; LibraryName: MICROCHIP; DeviceSetName: MCP4018; NAME: *
U$18 = LMV321L: STM LMV321LRail to Rail General Purpose Op-AmpDatasheet; GateName_1: G$1; SymbolName_1: OP-AMP; LibraryName: STM; DeviceSetName: LMV321L; NAME: *
U$36-U$39 = BZT52C: DIODES INC BZT52C Small form factor Zener Diode Datasheet; GateName_1: G$1; SymbolName_1: DIODE-ZENER; LibraryName: DIODES_INC; DeviceSetName: BZT52C; NAME: *

## Sheet Shutdown_2019_v1.1_RTDS.SchDoc: Shutdown_2019_v1.1
size 453 x 301 mm; Date: 1/4/2019 10:42:27 PM; SheetNumber: 10; GateName_1: G$1; SymbolName_1: FRAME_B_L; LibraryName: frames; DeviceSetName: FRAME_B_L; GateName_2: G$2; SymbolName_2: DOCFIELD
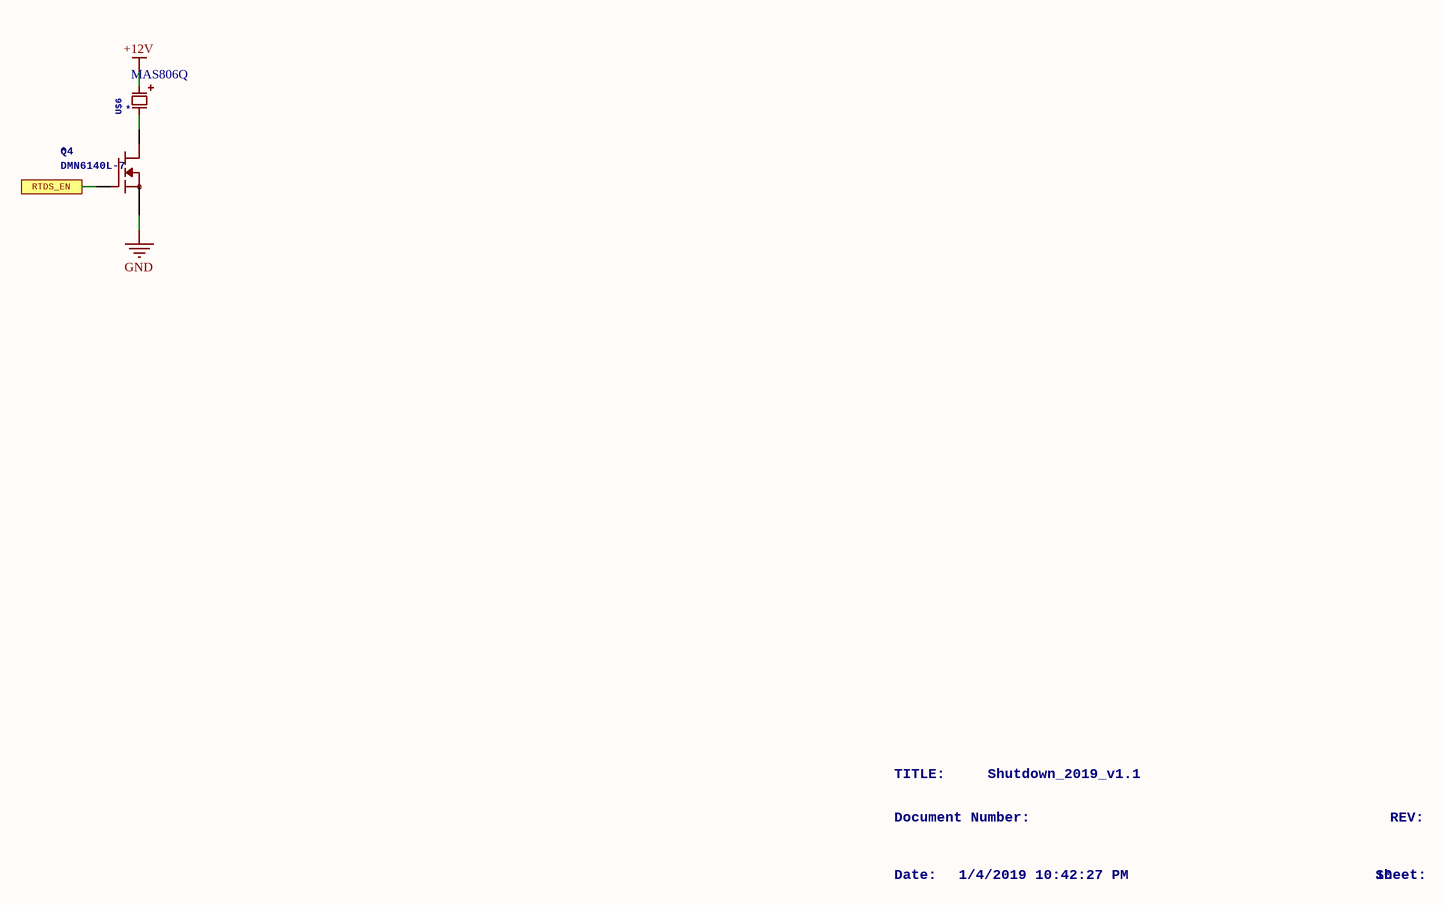
[diagram p5: Shutdown_2019_v1.1_RTDS.SchDoc]

### Parts
Q4  DMN6140L-7  [SOT23]
U$6  MAS806Q  [MAS806Q]

### Ports
RTDS_EN

### Nets
+12V: U$6.POS(A)
GND: Q4.2(S)
NetQ4_1: Q4.1(G) ; port RTDS_EN
NetQ4_3: Q4.3(D) U$6.NEG(B)

### Notes on the sheet
- TITLE:
- Document Number:
- Shutdown_2019_v1.1
- REV:
- Date:
- 1/4/2019 10:42:27 PM
- Sheet:
- 10
- 1
- 2
- 3
- 4
- 5
- 6
- 7
- 8
- 9
- A
- B
- C
- D
- E
- F

### Library data of the parts
Q4 = DMN6140L-7: as Q1 on sheet Shutdown_2019_v1.1_Faults; LibraryName: TRANS; DeviceSetName: DMN6140L-7; NAME: *
U$6 = MAS806Q: Mallory MAS806Q  PiezoElectric Buzzer  6-14V -- 103dB -- 50mA buzzerDatasheet; GateName_1: G$1; SymbolName_1: PIEZOELECTRIC; LibraryName: MALLORY; DeviceSetName: MAS806Q; NAME: *

## Nets that join several sheets
+3V3: Shutdown_2019_v1.1_Faults (R12.2 R13.2 R14.2), Shutdown_2019_v1.1_Power (C11.1 D11.A U$9.2 4), Shutdown_2019_v1.1_TractionCtl (9 pins)
+5V: Shutdown_2019_v1.1_BSPD (20 pins), Shutdown_2019_v1.1_Power (C14.1 D12.A U$10.2 4), Shutdown_2019_v1.1_TractionCtl (6 pins)
+12V: Shutdown_2019_v1.1_Faults (7 pins), Shutdown_2019_v1.1_BSPD (R5.2), Shutdown_2019_v1.1_Power (6 pins), Shutdown_2019_v1.1_RTDS (U$6.POS)
GND: Shutdown_2019_v1.1_Faults (16 pins), Shutdown_2019_v1.1_BSPD (25 pins), Shutdown_2019_v1.1_BrakeLight (U$4.2), Shutdown_2019_v1.1_Power (9 pins), Shutdown_2019_v1.1_TractionCtl (17 pins), Shutdown_2019_v1.1_RTDS (Q4.2)
NetQ5_1: Shutdown_2019_v1.1_Faults (Q5.1), Shutdown_2019_v1.1_BSPD (Q12.3 Q14.3 R5.1)